# Altium schematic sheet S03-BEAGLEBONE.SchDoc
size B; SheetNumber: 4; SheetTotal: 7; BLOCK-TITLE: BEAGLEBONE BLACK INTERFACES; BLOCK-SIZE: B; BLOCK-PROJECT: MULTIMOD BASE; BLOCK-REVISION: 1; BLOCK-ORGANIZATION: UNIVERSITY OF FLORIDA; BLOCK-DESIGNER: MEHRON TALEBI; BLOCK-IDENTIFIER: SUMMER 2023; BLOCK-REVIEWER: MIKE STAPLETON
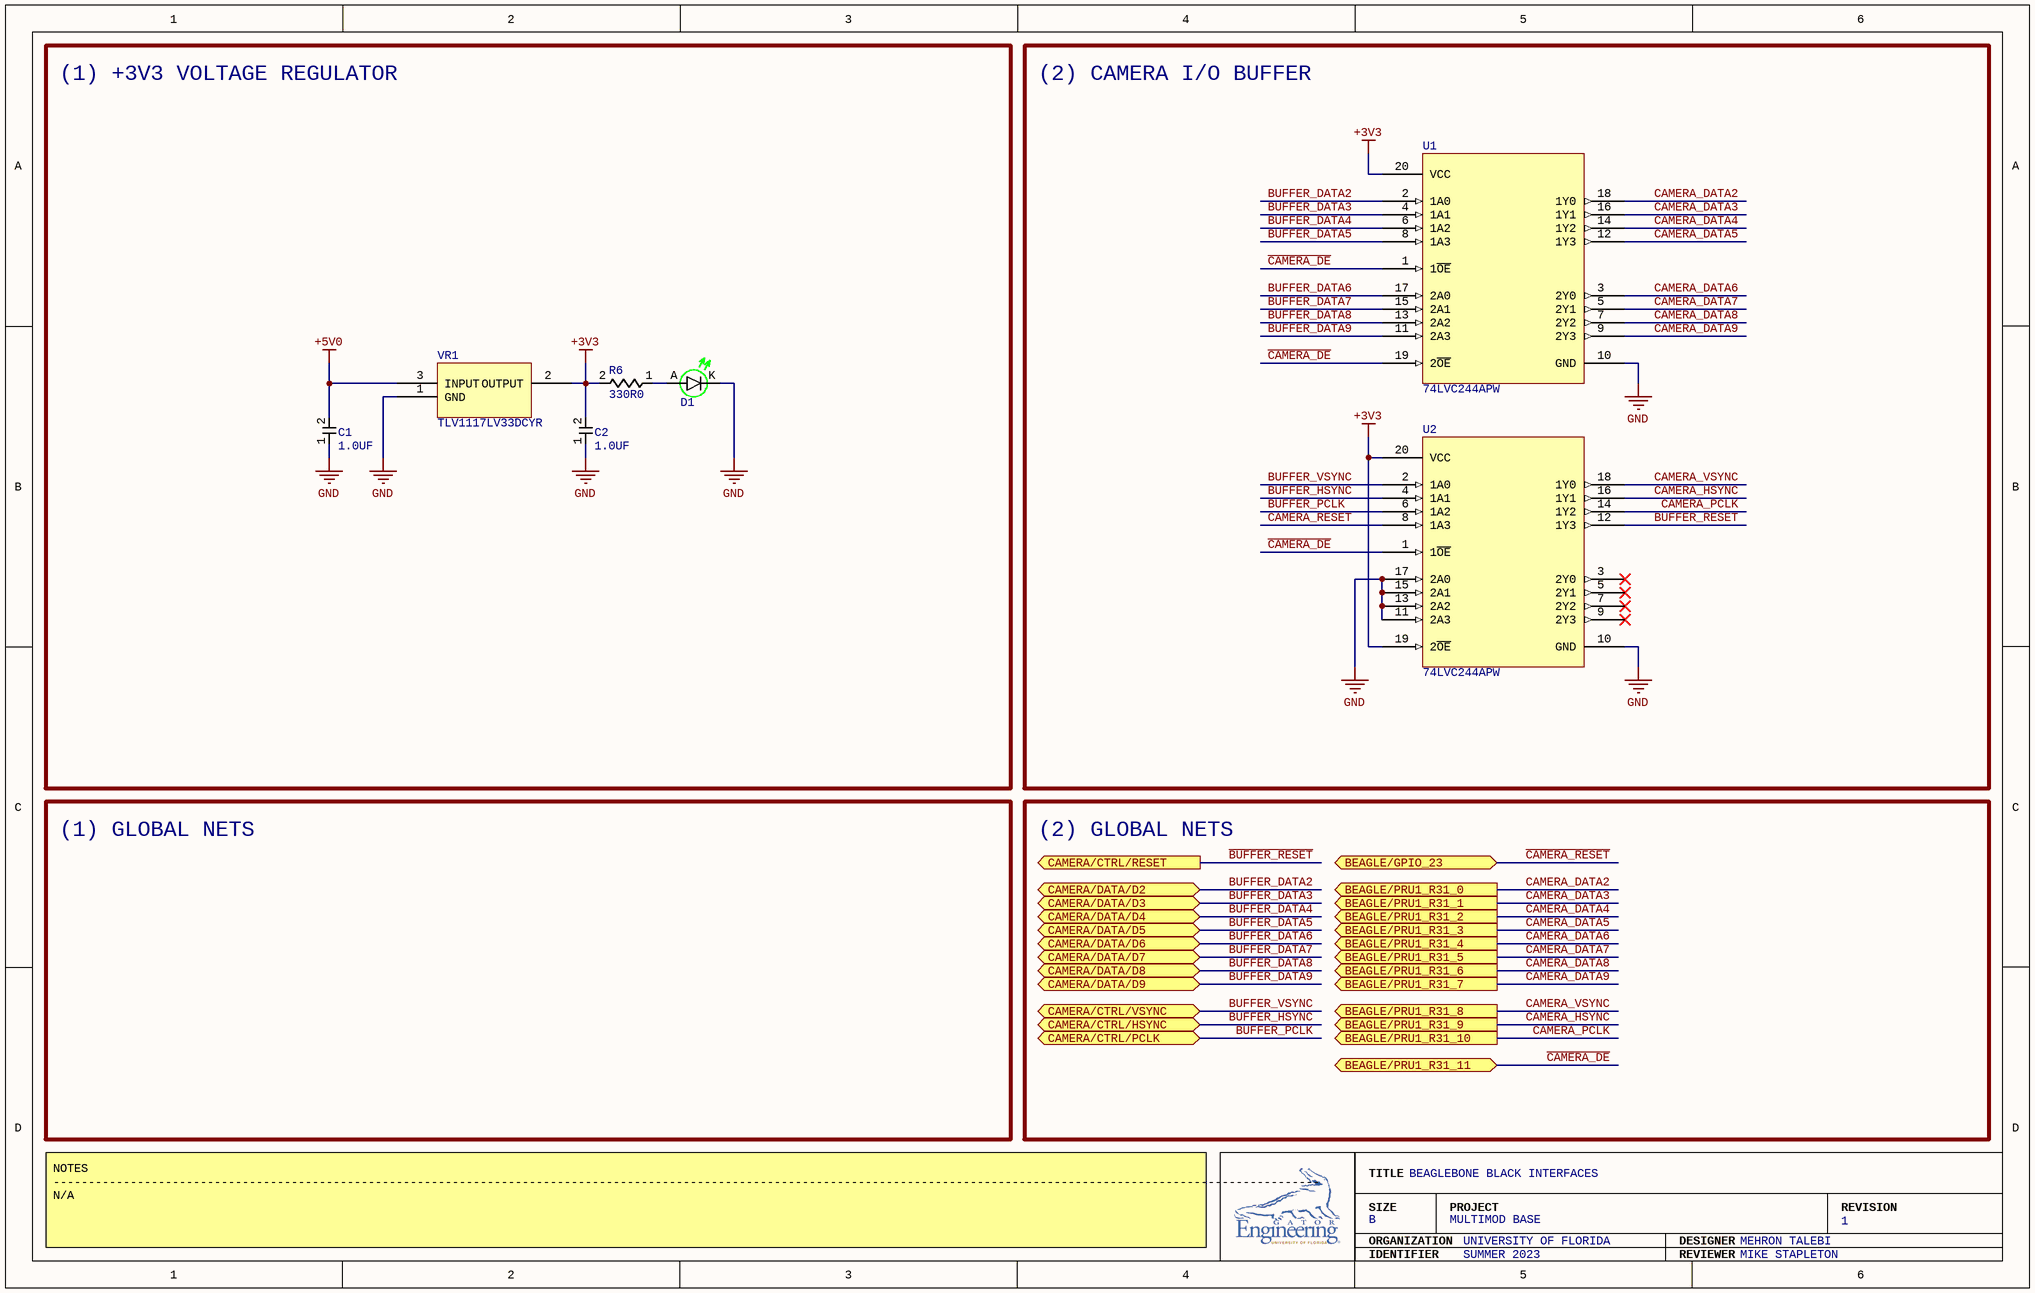
[diagram p0: S03-BEAGLEBONE.SchDoc]

## Parts
C1  1.0UF  [CL21B105KAFNFNE]
C2  1.0UF  [CL21B105KAFNFNE]
D1  LTST-C171GKT  [LTST-C171GKT]  (value not drawn)
R6  330R0  [RC0805FR-7W330RL]
U1  74LVC244APW  [74LVC244APW]
U2  74LVC244APW  [74LVC244APW]
VR1  TLV1117LV33DCYR  [TLV1117LV33DCYR]

## Blocks framed on the sheet
(1) +3V3 VOLTAGE REGULATOR: C1 C2 D1 R6 VR1
(2) CAMERA I/O BUFFER: U1 U2

## Ports
BEAGLE/GPIO_23 (bidir), BEAGLE/PRU1_R31_0 (out), BEAGLE/PRU1_R31_1 (out), BEAGLE/PRU1_R31_2 (out), BEAGLE/PRU1_R31_3 (out), BEAGLE/PRU1_R31_4 (out), BEAGLE/PRU1_R31_5 (out), BEAGLE/PRU1_R31_6 (out), BEAGLE/PRU1_R31_7 (out), BEAGLE/PRU1_R31_8 (out), BEAGLE/PRU1_R31_9 (out), BEAGLE/PRU1_R31_10 (out), BEAGLE/PRU1_R31_11 (bidir), CAMERA/CTRL/HSYNC (bidir), CAMERA/CTRL/PCLK (bidir), CAMERA/CTRL/RESET (out), CAMERA/CTRL/VSYNC (bidir), CAMERA/DATA/D2 (bidir), CAMERA/DATA/D3 (bidir), CAMERA/DATA/D4 (bidir), CAMERA/DATA/D5 (bidir), CAMERA/DATA/D6 (bidir), CAMERA/DATA/D7 (bidir), CAMERA/DATA/D8 (bidir), CAMERA/DATA/D9 (bidir)

## Nets
+3V3: C2.2 R6.2 U1.20(VCC) U2.19(2~{OE}) U2.20(VCC) VR1.2(OUTPUT)
+5V0: C1.2 VR1.3(INPUT)
GND: C1.1 C2.1 D1.K U1.10(GND) U2.10(GND) U2.11(2A3) U2.13(2A2) U2.15(2A1) U2.17(2A0) VR1.1(GND)
~{BUFFER_RESET}: U2.12(1Y3) ; port CAMERA/CTRL/RESET
~{CAMERA_DE}: U1.1(1~{OE}) U1.19(2~{OE}) U2.1(1~{OE}) ; port BEAGLE/PRU1_R31_11
~{CAMERA_RESET}: U2.8(1A3) ; port BEAGLE/GPIO_23
BUFFER_DATA2: U1.2(1A0) ; port CAMERA/DATA/D2
BUFFER_DATA3: U1.4(1A1) ; port CAMERA/DATA/D3
BUFFER_DATA4: U1.6(1A2) ; port CAMERA/DATA/D4
BUFFER_DATA5: U1.8(1A3) ; port CAMERA/DATA/D5
BUFFER_DATA6: U1.17(2A0) ; port CAMERA/DATA/D6
BUFFER_DATA7: U1.15(2A1) ; port CAMERA/DATA/D7
BUFFER_DATA8: U1.13(2A2) ; port CAMERA/DATA/D8
BUFFER_DATA9: U1.11(2A3) ; port CAMERA/DATA/D9
BUFFER_HSYNC: U2.4(1A1) ; port CAMERA/CTRL/HSYNC
BUFFER_PCLK: U2.6(1A2) ; port CAMERA/CTRL/PCLK
BUFFER_VSYNC: U2.2(1A0) ; port CAMERA/CTRL/VSYNC
CAMERA_DATA2: U1.18(1Y0) ; port BEAGLE/PRU1_R31_0
CAMERA_DATA3: U1.16(1Y1) ; port BEAGLE/PRU1_R31_1
CAMERA_DATA4: U1.14(1Y2) ; port BEAGLE/PRU1_R31_2
CAMERA_DATA5: U1.12(1Y3) ; port BEAGLE/PRU1_R31_3
CAMERA_DATA6: U1.3(2Y0) ; port BEAGLE/PRU1_R31_4
CAMERA_DATA7: U1.5(2Y1) ; port BEAGLE/PRU1_R31_5
CAMERA_DATA8: U1.7(2Y2) ; port BEAGLE/PRU1_R31_6
CAMERA_DATA9: U1.9(2Y3) ; port BEAGLE/PRU1_R31_7
CAMERA_HSYNC: U2.16(1Y1) ; port BEAGLE/PRU1_R31_9
CAMERA_PCLK: U2.14(1Y2) ; port BEAGLE/PRU1_R31_10
CAMERA_VSYNC: U2.18(1Y0) ; port BEAGLE/PRU1_R31_8
NetD1_A: D1.A R6.1

Not connected (* = marked no-connect by the designer): U2 3(2Y0)* 5(2Y1)* 7(2Y2)* 9(2Y3)*

## Notes on the sheet
- (1) GLOBAL NETS
- (2) GLOBAL NETS
- NOTES
  -------------------------------------------------------------------------------------------------------------------------------------------------------------------------------------
  N/A
- TITLE
- SIZE
- ORGANIZATION
- PROJECT
- DESIGNER
- REVISION
- IDENTIFIER
- REVIEWER

## Library data of the parts
C1 C2 = CL21B105KAFNFNE: CAP CER 1UF 25V X7R 0805; Capacitance: 1 µF; Tolerance: ±10%; Voltage - Rated: 25V; Temperature Coefficient: X7R; Operating Temperature: -55°C ~ 125°C; Applications: General Purpose; Mounting Type: Surface Mount, MLCC; Package / Case: 0805 (2012 Metric); Size / Dimension: 0.079" L x 0.049" W (2.00mm x 1.25mm); Thickness (Max): 0.053" (1.35mm); Supplier 1: Arrow Electronics; Supplier Part Number 1: CL21B105KAFNFNE
D1 = LTST-C171GKT: LED GREEN CLEAR CHIP SMD; Configuration: Standard; Lens Color: Colorless; Millicandela Rating: 12mcd; Lens Style: Rectangle with Flat Top; Lens Size: 1.40mm x 1.25mm; Voltage - Forward (Vf) (Typ): 2.1V; Current - Test: 20mA; Viewing Angle: 130°; Wavelength - Dominant: 569nm; Wavelength - Peak: 565nm; Color: Green; Lens Transparency: Clear; Mounting Type: Surface Mount; Package / Case: 0805 (2012 Metric); Supplier Device Package: Chip LED; Size / Dimension: 2.00mm L x 1.25mm W; Height (Max): 0.90mm; Supplier 1: Digi-Key; Supplier Part Number 1: 160-1423-1-ND
R6 = RC0805FR-7W330RL: RES 330 OHM 1% 1/4W 0805; Resistance: 330 Ohms; Power (Watts): 0.25W, 1/4W; Temperature Coefficient: ±100ppm/°C; Tolerance: ±1%; Composition: Thick Film; Features: Moisture Resistant; Operating Temperature: -55°C ~ 155°C; Supplier Device Package: 0805; Size / Dimension: 0.079" L x 0.049" W (2.00mm x 1.25mm); Height - Seated (Max): 0.024" (0.60mm); Number of Terminations: 2; Supplier 1: Mouser; Supplier Part Number 1: 603-RC0805FR-7W330RL
U1 U2 = 74LVC244APW: IC BUF NON-INVERT 3.6V 20TSSOP; Logic Type: Buffer, Non-Inverting; Number of Elements: 2; Number of Bits per Element: 4; Output Type: 3-State; Current - Output High, Low: 24mA, 24mA; Voltage - Supply: 1.2V ~ 3.6V; Operating Temperature: -40°C ~ 125°C (TA); Mounting Type: Surface Mount; Package / Case: 20-TSSOP (0.173", 4.40mm Width); Supplier Device Package: 20-TSSOP; Supplier 1: Digi-Key; Supplier Part Number 1: 1727-2875-1-ND
VR1 = TLV1117LV33DCYR: IC REG LINEAR 3.3V 1A SOT223-4; Output Configuration: Positive; Output Type: Fixed; Number of Regulators: 1; Voltage - Input (Max): 5.5V; Voltage Dropout (Max): 1.3V @ 800mA; Current - Quiescent (Iq): 100 µA; PSRR: 75dB (120Hz); Protection Features: Over Current, Over Temperature; Voltage - Output (Min/Fixed): 3.3V; Current - Output: 1A; Operating Temperature: -40°C ~ 125°C; Mounting Type: Surface Mount; Package / Case: TO-261-4, TO-261AA; ComponentLink1Description: Datasheet; ComponentLink1URL: https://www.ti.com/lit/ds/symlink/tlv1117lv.pdf; Supplier 1: Digi-Key; Supplier Part Number 1: 296-28778-1-ND